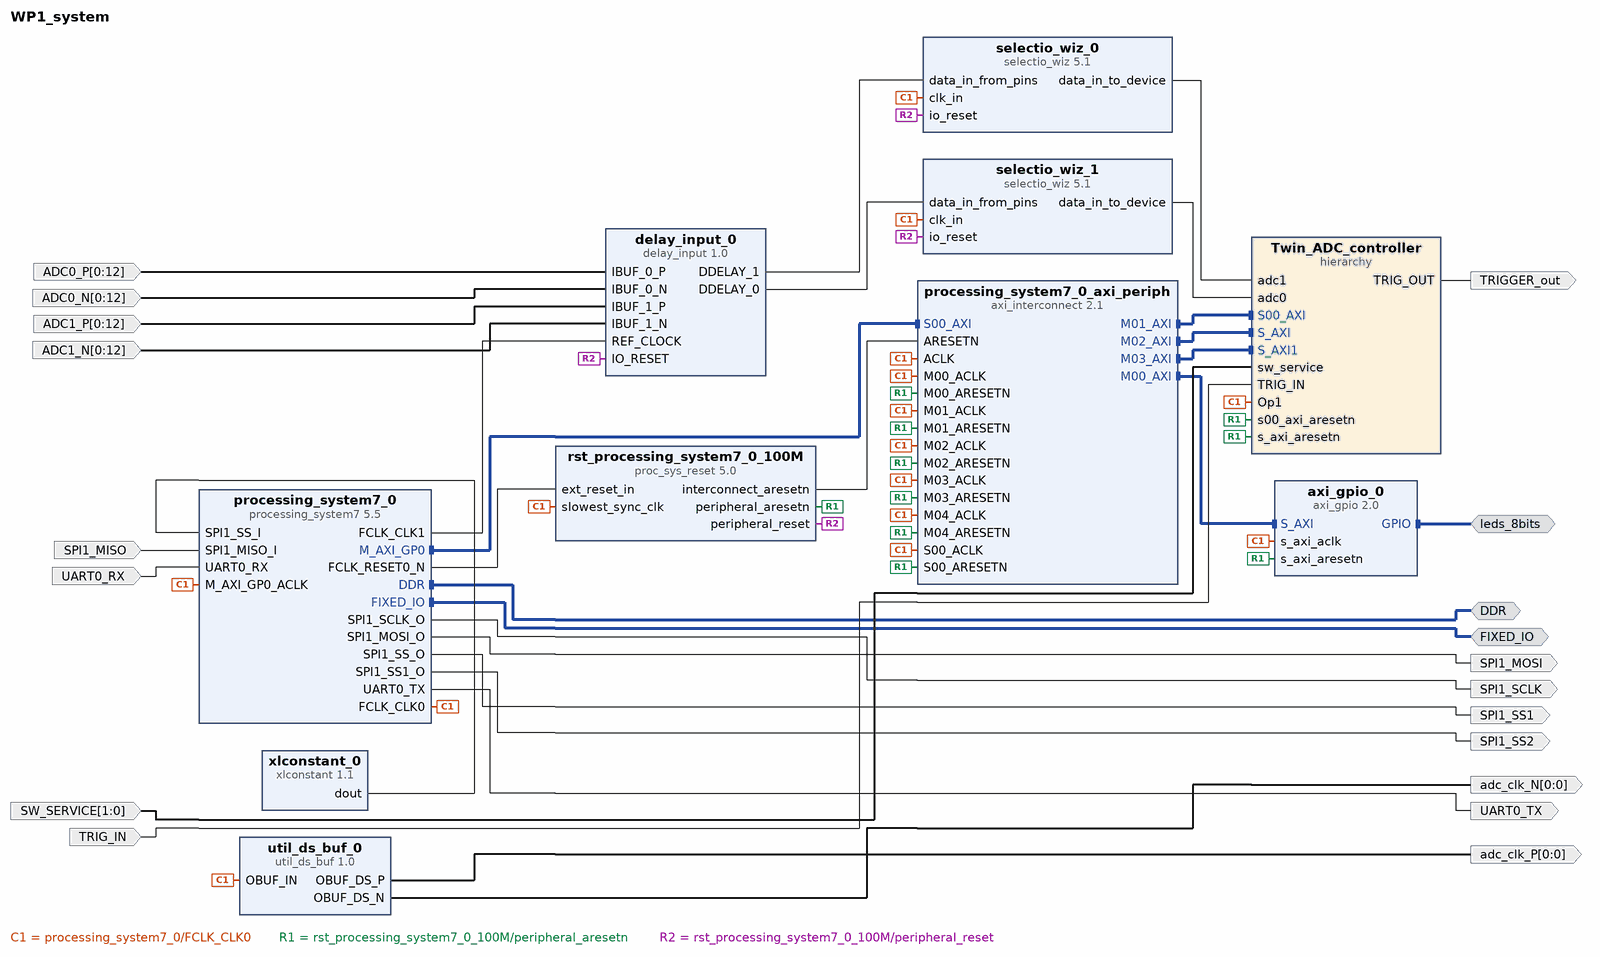
[diagram p0: block diagram of the top level]
# Vivado block design WP1_system, Vivado 2015.2
create_bd_design WP1_system

create_bd_intf_port -mode Master -vlnv xilinx.com:interface:ddrx_rtl:1.0 DDR
create_bd_intf_port -mode Master -vlnv xilinx.com:display_processing_system7:fixedio_rtl:1.0 FIXED_IO
create_bd_intf_port -mode Master -vlnv xilinx.com:interface:gpio_rtl:1.0 leds_8bits
create_bd_port -dir O -from 0 -to 0 adc_clk_P
create_bd_port -dir O -from 0 -to 0 adc_clk_N
create_bd_port -dir O SPI1_SCLK
create_bd_port -dir O SPI1_MOSI
create_bd_port -dir I SPI1_MISO
create_bd_port -dir O SPI1_SS1
create_bd_port -dir O SPI1_SS2
create_bd_port -dir O TRIGGER_out
create_bd_port -dir I -from 0 -to 12 ADC0_P
create_bd_port -dir I -from 0 -to 12 ADC0_N
create_bd_port -dir I -from 0 -to 12 ADC1_P
create_bd_port -dir I -from 0 -to 12 ADC1_N
create_bd_port -dir I -from 1 -to 0 SW_SERVICE
create_bd_port -dir O UART0_TX
create_bd_port -dir I UART0_RX
create_bd_port -dir I TRIG_IN

create_bd_cell -type ip -vlnv xilinx.com:ip:util_ds_buf:1.0 util_ds_buf_0
set_property -dict {CONFIG.C_BUF_TYPE OBUFDS} [get_bd_cells util_ds_buf_0]
create_bd_cell -type hier Twin_ADC_controller
create_bd_cell -type ip -vlnv in2p3.fr:user:delay_input:1.0 delay_input_0
create_bd_cell -type ip -vlnv xilinx.com:ip:axi_gpio:2.0 axi_gpio_0
set_property -dict [list \
  CONFIG.C_IS_DUAL 0 \
  CONFIG.C_INTERRUPT_PRESENT 0 \
  CONFIG.USE_BOARD_FLOW true \
  CONFIG.GPIO_BOARD_INTERFACE leds_8bits \
  CONFIG.GPIO2_BOARD_INTERFACE Custom \
] [get_bd_cells axi_gpio_0]
create_bd_cell -type ip -vlnv xilinx.com:ip:processing_system7:5.5 processing_system7_0
set_property -dict [list \
  CONFIG.PCW_FPGA0_PERIPHERAL_FREQMHZ 125 \
  CONFIG.PCW_FPGA1_PERIPHERAL_FREQMHZ 200 \
  CONFIG.PCW_EN_CLK1_PORT 1 \
  CONFIG.PCW_PRESET_BANK1_VOLTAGE {LVCMOS 3.3V} \
  CONFIG.PCW_UART0_PERIPHERAL_ENABLE 1 \
  CONFIG.PCW_UART0_UART0_IO EMIO \
  CONFIG.PCW_UART1_PERIPHERAL_ENABLE 1 \
  CONFIG.PCW_UART1_UART1_IO {MIO 48 .. 49} \
  CONFIG.PCW_SPI1_PERIPHERAL_ENABLE 1 \
  CONFIG.PCW_TTC0_PERIPHERAL_ENABLE 1 \
  CONFIG.PCW_I2C0_PERIPHERAL_ENABLE 1 \
  CONFIG.PCW_I2C0_I2C0_IO {MIO 14 .. 15} \
  CONFIG.PCW_I2C0_GRP_INT_ENABLE 0 \
  CONFIG.PCW_GPIO_MIO_GPIO_ENABLE 1 \
  CONFIG.preset ZedBoard \
] [get_bd_cells processing_system7_0]
# 7 more settings of processing_system7_0 are not shown: defaults, MIO pin electricals, DDR timing, and values the tool derives
create_bd_cell -type ip -vlnv xilinx.com:ip:axi_interconnect:2.1 processing_system7_0_axi_periph
set_property -dict [list \
  CONFIG.NUM_MI 5 \
  CONFIG.STRATEGY 2 \
  CONFIG.ENABLE_ADVANCED_OPTIONS 1 \
] [get_bd_cells processing_system7_0_axi_periph]
create_bd_cell -type ip -vlnv xilinx.com:ip:proc_sys_reset:5.0 rst_processing_system7_0_100M
create_bd_cell -type ip -vlnv xilinx.com:ip:selectio_wiz:5.1 selectio_wiz_0
set_property -dict [list \
  CONFIG.BUS_IO_STD LVCMOS25 \
  CONFIG.SELIO_ACTIVE_EDGE DDR \
  CONFIG.SYSTEM_DATA_WIDTH 13 \
  CONFIG.SELIO_BUS_IN_DELAY NONE \
  CONFIG.SELIO_CLK_BUF MMCM \
] [get_bd_cells selectio_wiz_0]
create_bd_cell -type ip -vlnv xilinx.com:ip:selectio_wiz:5.1 selectio_wiz_1
set_property -dict [list \
  CONFIG.BUS_IO_STD LVCMOS25 \
  CONFIG.SELIO_ACTIVE_EDGE DDR \
  CONFIG.SYSTEM_DATA_WIDTH 13 \
  CONFIG.SELIO_BUS_IN_DELAY NONE \
  CONFIG.SELIO_CLK_BUF MMCM \
] [get_bd_cells selectio_wiz_1]
create_bd_cell -type ip -vlnv xilinx.com:ip:xlconstant:1.1 xlconstant_0

# ---- hierarchy /Twin_ADC_controller ----
current_bd_instance /Twin_ADC_controller
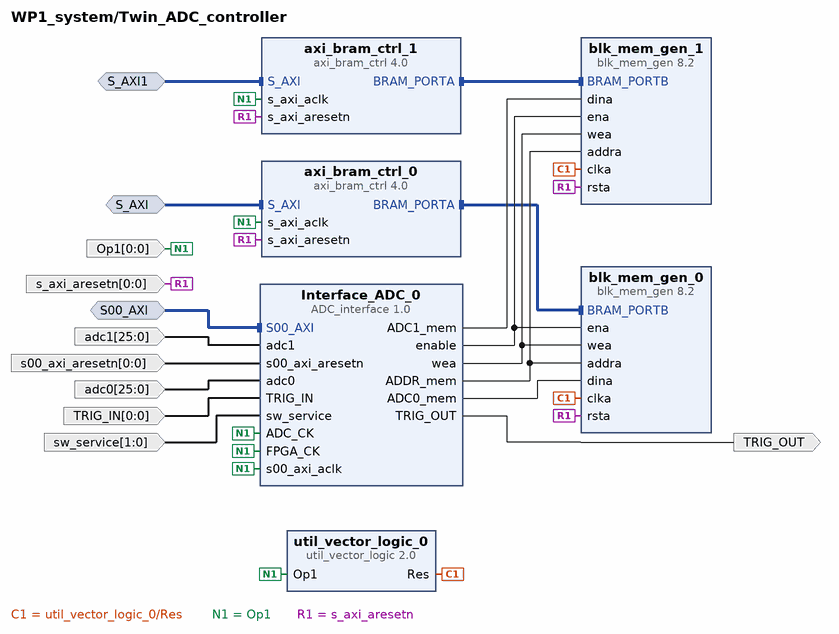
[diagram p1: block diagram inside /Twin_ADC_controller]
create_bd_intf_pin -mode Slave -vlnv xilinx.com:interface:aximm_rtl:1.0 S_AXI
create_bd_intf_pin -mode Slave -vlnv xilinx.com:interface:aximm_rtl:1.0 S_AXI1
create_bd_intf_pin -mode Slave -vlnv xilinx.com:interface:aximm_rtl:1.0 S00_AXI
create_bd_pin -dir I -from 0 -to 0 Op1
create_bd_pin -dir I -from 0 -to 0 -type rst s_axi_aresetn
create_bd_pin -dir I -from 25 -to 0 adc1
create_bd_pin -dir I -from 0 -to 0 -type rst s00_axi_aresetn
create_bd_pin -dir O TRIG_OUT
create_bd_pin -dir I -from 25 -to 0 adc0
create_bd_pin -dir I -from 0 -to 0 TRIG_IN
create_bd_pin -dir I -from 1 -to 0 sw_service

create_bd_cell -type ip -vlnv le.infn.it:user:ADC_interface:1.0 Interface_ADC_0
create_bd_cell -type ip -vlnv xilinx.com:ip:axi_bram_ctrl:4.0 axi_bram_ctrl_0
set_property -dict {CONFIG.SINGLE_PORT_BRAM 1} [get_bd_cells axi_bram_ctrl_0]
create_bd_cell -type ip -vlnv xilinx.com:ip:axi_bram_ctrl:4.0 axi_bram_ctrl_1
set_property -dict {CONFIG.SINGLE_PORT_BRAM 1} [get_bd_cells axi_bram_ctrl_1]
create_bd_cell -type ip -vlnv xilinx.com:ip:blk_mem_gen:8.2 blk_mem_gen_0
set_property -dict {CONFIG.Memory_Type True_Dual_Port_RAM} [get_bd_cells blk_mem_gen_0]
create_bd_cell -type ip -vlnv xilinx.com:ip:blk_mem_gen:8.2 blk_mem_gen_1
set_property -dict {CONFIG.Memory_Type True_Dual_Port_RAM} [get_bd_cells blk_mem_gen_1]
create_bd_cell -type ip -vlnv xilinx.com:ip:util_vector_logic:2.0 util_vector_logic_0
set_property -dict {CONFIG.C_SIZE 1 CONFIG.C_OPERATION not} [get_bd_cells util_vector_logic_0]

# ---- connections ----

current_bd_instance /Twin_ADC_controller
connect_bd_intf_net [get_bd_intf_pins axi_bram_ctrl_0/BRAM_PORTA] [get_bd_intf_pins blk_mem_gen_0/BRAM_PORTB]
connect_bd_intf_net [get_bd_intf_pins axi_bram_ctrl_1/BRAM_PORTA] [get_bd_intf_pins blk_mem_gen_1/BRAM_PORTB]
connect_bd_intf_net [get_bd_intf_pins S_AXI] [get_bd_intf_pins axi_bram_ctrl_0/S_AXI]
connect_bd_intf_net [get_bd_intf_pins S_AXI1] [get_bd_intf_pins axi_bram_ctrl_1/S_AXI]
connect_bd_intf_net [get_bd_intf_pins S00_AXI] [get_bd_intf_pins Interface_ADC_0/S00_AXI]
connect_bd_net [get_bd_pins util_vector_logic_0/Res] [get_bd_pins blk_mem_gen_0/clka] [get_bd_pins blk_mem_gen_1/clka]
connect_bd_net [get_bd_pins Interface_ADC_0/enable] [get_bd_pins blk_mem_gen_0/ena] [get_bd_pins blk_mem_gen_1/ena]
connect_bd_net [get_bd_pins Interface_ADC_0/wea] [get_bd_pins blk_mem_gen_0/wea] [get_bd_pins blk_mem_gen_1/wea]
connect_bd_net [get_bd_pins Interface_ADC_0/ADDR_mem] [get_bd_pins blk_mem_gen_0/addra] [get_bd_pins blk_mem_gen_1/addra]
connect_bd_net [get_bd_pins Interface_ADC_0/ADC0_mem] [get_bd_pins blk_mem_gen_0/dina]
connect_bd_net [get_bd_pins Interface_ADC_0/ADC1_mem] [get_bd_pins blk_mem_gen_1/dina]
connect_bd_net -net processing_system7_0_FCLK_CLK0 [get_bd_pins Op1] \
  [get_bd_pins Interface_ADC_0/ADC_CK] [get_bd_pins Interface_ADC_0/FPGA_CK] [get_bd_pins Interface_ADC_0/s00_axi_aclk] \
  [get_bd_pins axi_bram_ctrl_0/s_axi_aclk] [get_bd_pins axi_bram_ctrl_1/s_axi_aclk] [get_bd_pins util_vector_logic_0/Op1]
connect_bd_net -net rst_processing_system7_0_100M_peripheral_aresetn [get_bd_pins s_axi_aresetn] \
  [get_bd_pins axi_bram_ctrl_0/s_axi_aresetn] [get_bd_pins axi_bram_ctrl_1/s_axi_aresetn] [get_bd_pins blk_mem_gen_0/rsta] \
  [get_bd_pins blk_mem_gen_1/rsta]
connect_bd_net -net selectio_wiz_0_data_in_to_device [get_bd_pins adc1] [get_bd_pins Interface_ADC_0/adc1]
connect_bd_net -net util_vector_logic_1_Res [get_bd_pins s00_axi_aresetn] [get_bd_pins Interface_ADC_0/s00_axi_aresetn]
connect_bd_net [get_bd_pins Interface_ADC_0/TRIG_OUT] [get_bd_pins TRIG_OUT]
connect_bd_net -net selectio_wiz_1_data_in_to_device [get_bd_pins adc0] [get_bd_pins Interface_ADC_0/adc0]
connect_bd_net [get_bd_pins TRIG_IN] [get_bd_pins Interface_ADC_0/TRIG_IN]
connect_bd_net [get_bd_pins sw_service] [get_bd_pins Interface_ADC_0/sw_service]

current_bd_instance /
connect_bd_intf_net [get_bd_intf_pins processing_system7_0/M_AXI_GP0] [get_bd_intf_pins processing_system7_0_axi_periph/S00_AXI]
connect_bd_intf_net [get_bd_intf_pins processing_system7_0_axi_periph/M00_AXI] [get_bd_intf_pins axi_gpio_0/S_AXI]
connect_bd_intf_net [get_bd_intf_pins processing_system7_0_axi_periph/M01_AXI] [get_bd_intf_pins Twin_ADC_controller/S00_AXI]
connect_bd_intf_net [get_bd_intf_pins processing_system7_0_axi_periph/M02_AXI] [get_bd_intf_pins Twin_ADC_controller/S_AXI]
connect_bd_intf_net [get_bd_intf_pins processing_system7_0_axi_periph/M03_AXI] [get_bd_intf_pins Twin_ADC_controller/S_AXI1]
connect_bd_intf_net [get_bd_intf_ports DDR] [get_bd_intf_pins processing_system7_0/DDR]
connect_bd_intf_net [get_bd_intf_ports FIXED_IO] [get_bd_intf_pins processing_system7_0/FIXED_IO]
connect_bd_intf_net [get_bd_intf_ports leds_8bits] [get_bd_intf_pins axi_gpio_0/GPIO]
connect_bd_net [get_bd_pins processing_system7_0/FCLK_CLK0] \
  [get_bd_pins util_ds_buf_0/OBUF_IN] [get_bd_pins Twin_ADC_controller/Op1] [get_bd_pins axi_gpio_0/s_axi_aclk] \
  [get_bd_pins processing_system7_0/M_AXI_GP0_ACLK] [get_bd_pins processing_system7_0_axi_periph/ACLK] \
  [get_bd_pins processing_system7_0_axi_periph/S00_ACLK] [get_bd_pins processing_system7_0_axi_periph/M00_ACLK] \
  [get_bd_pins processing_system7_0_axi_periph/M01_ACLK] [get_bd_pins processing_system7_0_axi_periph/M02_ACLK] \
  [get_bd_pins processing_system7_0_axi_periph/M03_ACLK] [get_bd_pins processing_system7_0_axi_periph/M04_ACLK] \
  [get_bd_pins rst_processing_system7_0_100M/slowest_sync_clk] [get_bd_pins selectio_wiz_0/clk_in] \
  [get_bd_pins selectio_wiz_1/clk_in]
connect_bd_net [get_bd_pins processing_system7_0/FCLK_RESET0_N] [get_bd_pins rst_processing_system7_0_100M/ext_reset_in]
connect_bd_net [get_bd_pins rst_processing_system7_0_100M/peripheral_aresetn] \
  [get_bd_pins Twin_ADC_controller/s_axi_aresetn] [get_bd_pins Twin_ADC_controller/s00_axi_aresetn] \
  [get_bd_pins axi_gpio_0/s_axi_aresetn] [get_bd_pins processing_system7_0_axi_periph/S00_ARESETN] \
  [get_bd_pins processing_system7_0_axi_periph/M00_ARESETN] [get_bd_pins processing_system7_0_axi_periph/M01_ARESETN] \
  [get_bd_pins processing_system7_0_axi_periph/M02_ARESETN] [get_bd_pins processing_system7_0_axi_periph/M03_ARESETN] \
  [get_bd_pins processing_system7_0_axi_periph/M04_ARESETN]
connect_bd_net [get_bd_pins rst_processing_system7_0_100M/interconnect_aresetn] [get_bd_pins processing_system7_0_axi_periph/ARESETN]
connect_bd_net [get_bd_pins util_ds_buf_0/OBUF_DS_P] [get_bd_ports adc_clk_P]
connect_bd_net [get_bd_pins util_ds_buf_0/OBUF_DS_N] [get_bd_ports adc_clk_N]
connect_bd_net [get_bd_pins rst_processing_system7_0_100M/peripheral_reset] \
  [get_bd_pins delay_input_0/IO_RESET] [get_bd_pins selectio_wiz_0/io_reset] [get_bd_pins selectio_wiz_1/io_reset]
connect_bd_net [get_bd_pins xlconstant_0/dout] [get_bd_pins processing_system7_0/SPI1_SS_I]
connect_bd_net [get_bd_pins processing_system7_0/SPI1_SCLK_O] [get_bd_ports SPI1_SCLK]
connect_bd_net [get_bd_pins processing_system7_0/SPI1_MOSI_O] [get_bd_ports SPI1_MOSI]
connect_bd_net [get_bd_ports SPI1_MISO] [get_bd_pins processing_system7_0/SPI1_MISO_I]
connect_bd_net [get_bd_pins processing_system7_0/SPI1_SS_O] [get_bd_ports SPI1_SS1]
connect_bd_net [get_bd_pins processing_system7_0/SPI1_SS1_O] [get_bd_ports SPI1_SS2]
connect_bd_net [get_bd_pins selectio_wiz_0/data_in_to_device] [get_bd_pins Twin_ADC_controller/adc1]
connect_bd_net -net Interface_ADC_0_TRIG_OUT [get_bd_pins Twin_ADC_controller/TRIG_OUT] [get_bd_ports TRIGGER_out]
connect_bd_net [get_bd_pins processing_system7_0/FCLK_CLK1] [get_bd_pins delay_input_0/REF_CLOCK]
connect_bd_net [get_bd_pins selectio_wiz_1/data_in_to_device] [get_bd_pins Twin_ADC_controller/adc0]
connect_bd_net [get_bd_pins delay_input_0/DDELAY_0] [get_bd_pins selectio_wiz_1/data_in_from_pins]
connect_bd_net [get_bd_pins delay_input_0/DDELAY_1] [get_bd_pins selectio_wiz_0/data_in_from_pins]
connect_bd_net [get_bd_ports ADC0_P] [get_bd_pins delay_input_0/IBUF_0_P]
connect_bd_net [get_bd_ports ADC0_N] [get_bd_pins delay_input_0/IBUF_0_N]
connect_bd_net [get_bd_ports ADC1_P] [get_bd_pins delay_input_0/IBUF_1_P]
connect_bd_net [get_bd_ports ADC1_N] [get_bd_pins delay_input_0/IBUF_1_N]
connect_bd_net [get_bd_ports SW_SERVICE] [get_bd_pins Twin_ADC_controller/sw_service]
connect_bd_net [get_bd_pins processing_system7_0/UART0_TX] [get_bd_ports UART0_TX]
connect_bd_net [get_bd_ports UART0_RX] [get_bd_pins processing_system7_0/UART0_RX]
connect_bd_net [get_bd_ports TRIG_IN] [get_bd_pins Twin_ADC_controller/TRIG_IN]

# ---- address map ----
assign_bd_address -offset 0x40000000 -range 16K -target_address_space [get_bd_addr_spaces processing_system7_0/Data] [get_bd_addr_segs Twin_ADC_controller/axi_bram_ctrl_0/S_AXI/Mem0]
assign_bd_address -offset 0x40010000 -range 16K -target_address_space [get_bd_addr_spaces processing_system7_0/Data] [get_bd_addr_segs Twin_ADC_controller/axi_bram_ctrl_1/S_AXI/Mem0]
assign_bd_address -offset 0x41200000 -range 4K -target_address_space [get_bd_addr_spaces processing_system7_0/Data] [get_bd_addr_segs axi_gpio_0/S_AXI/Reg]
assign_bd_address -offset 0x43C00000 -range 4K -target_address_space [get_bd_addr_spaces processing_system7_0/Data] [get_bd_addr_segs Twin_ADC_controller/Interface_ADC_0/S00_AXI/S00_AXI_reg]

validate_bd_design
save_bd_design
